# Altium schematic sheet 1.power.SchDoc: 接口及电源
size A4; DrawnBy: 蒋朝晖; Organization: Seneasy; DocumentNumber: 项目编号; Revision: V2.0; SheetNumber: 1; SheetTotal: 2; Time: 2018-10-21
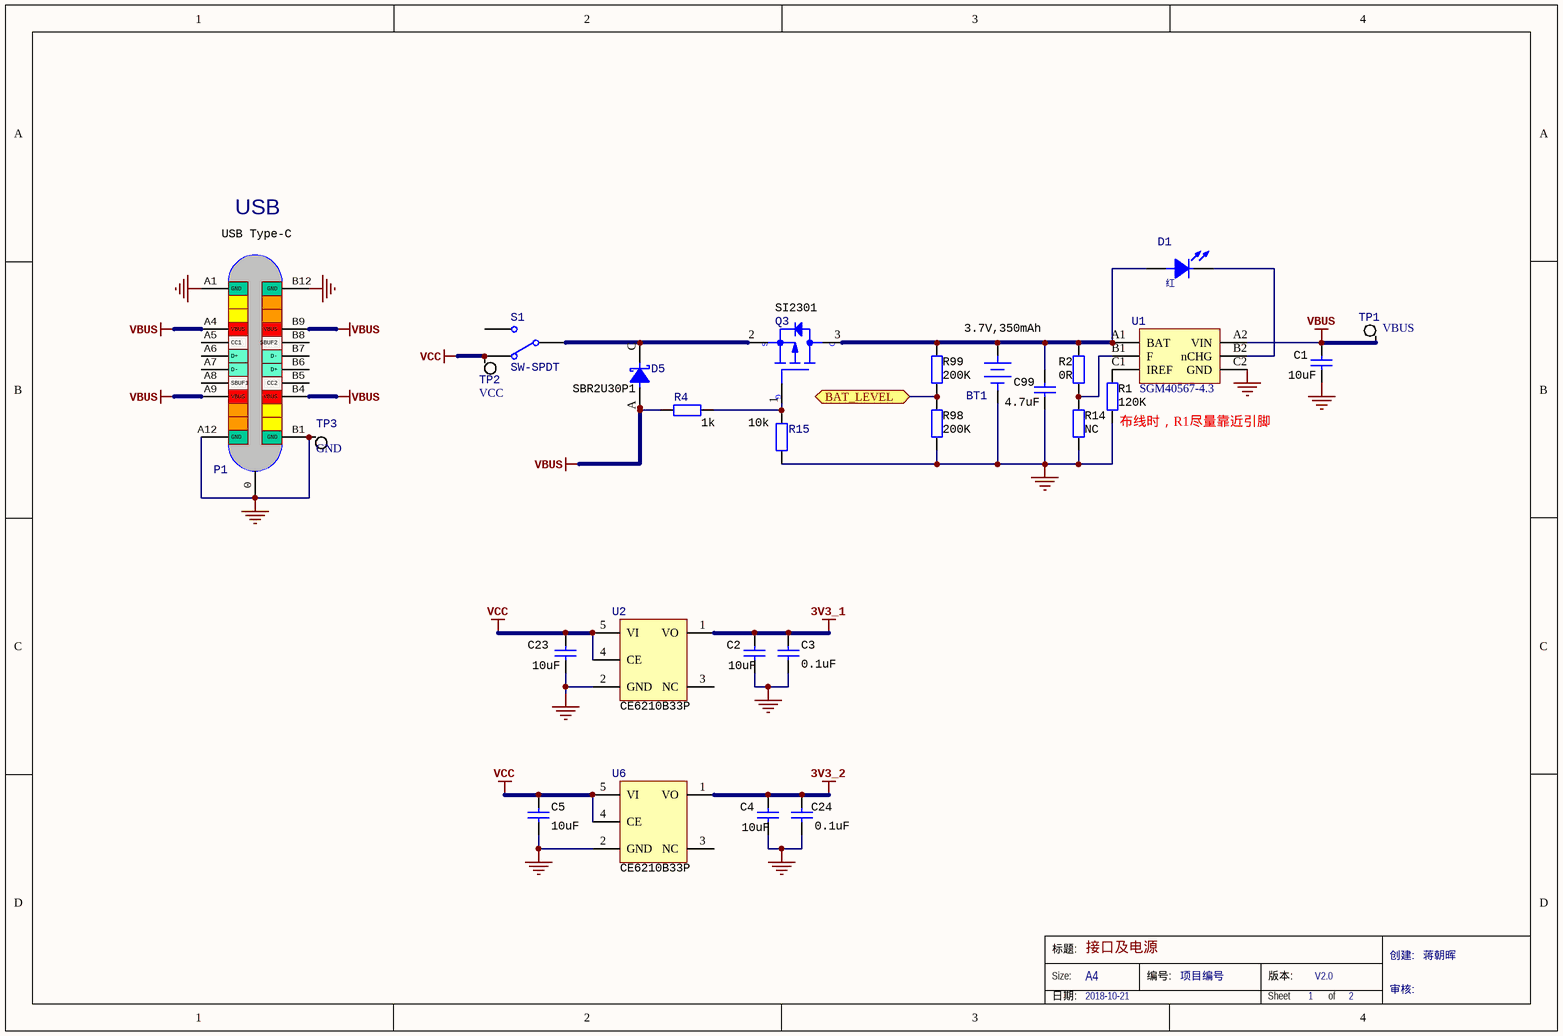
[diagram p0: 1.power.SchDoc]

## Parts
BT1  3.7V,350mAh  [2P/1.0MM立式贴片座子]
C1  10uF  [C0603]
C2  10uF  [0603]
C3  0.1uF  [0402]
C4  10uF  [0603]
C5  10uF  [0603]
C23  10uF  [0603]
C24  0.1uF  [0402]
C99  4.7uF  [C0603]
D1  红  [0603LED]
D5  SBR2U30P1  [POWERDI123]
P1  USB Type-C  [TYPC-16PIN]
Q3  SI2301  [SOT23-3]
R1  120K  [R0402]
R2  0R  [R0402]
R4  1k  [R0402]
R14  NC  [R0402]
R15  10k  [R0402]
R98  200K  [R0402]
R99  200K  [R0402]
S1  SW-SPDT  [SW2]
TP1  VBUS  [测试点]
TP2  VCC  [测试点]
TP3  GND  [测试点]
U1  SGM40567-4.3  [SGM40567]
U2  CE6210B33P  [SOT89-5]
U6  CE6210B33P  [SOT89-5]

## Ports
BAT_LEVEL (bidir)

## Nets
3V3_1: C2.1 C3.2 U2.1(VO)
3V3_2: C4.1 C24.2 U6.1(VO)
NetBT1_2: BT1.2(-) C1.2 C2.2 C3.1 C4.2 C5.2 C23.2 C24.1 C99.2 P1.0(Shield) P1.A1(GND) P1.A12(GND) P1.B1(GND) P1.B12(GND) R1.1 R14.2 R15.1 R98.1 TP3.1 U1.C2(GND) U2.2(GND) U6.2(GND)
VBUS: C1.1 D5.A(ANODE) P1.A4(VBUS) P1.A9(VBUS) P1.B4(VBUS) P1.B9(VBUS) R4.2 TP1.1 U1.A2(VIN)
VCC: C5.1 C23.1 S1.3 TP2.1 U2.4(CE) U2.5(VI) U6.4(CE) U6.5(VI)
BAT_LEVEL: R98.2 R99.1 ; port BAT_LEVEL
NetBT1_1: BT1.1(+) C99.1 D1.A(ANODE) Q3.3(DRAIN) R2.1 R99.2 U1.A1(BAT)
NetD1_C: D1.C(CATHODE) U1.B2(nCHG)
NetD5_C: D5.C(CATHODE) Q3.2(SOURCE) S1.2
NetQ3_1: Q3.1(GATE) R4.1 R15.2
NetR1_2: R1.2 U1.C1(IREF)
NetR2_2: R2.2 R14.1 U1.B1(F)

Not connected (* = marked no-connect by the designer): P1 A5(CC1) A6(D+) A7(D-) A8(SBUF1) B5(CC2) B6(D+) B7(D-) B8(SBUF2); S1 1; U2 3(NC); U6 3(NC)

## Notes on the sheet
- USB
- (near R1) 布线时，R1尽量靠近引脚
- 标题:
- Size:
- A4
- 编号:
- 版本:
- 创建:
- 日期:
- Sheet
- of
- 审核:
- (in symbol PMOS) S; D; G

## Library data of the parts
BT1 = Battery: 4.2V Li-lon; Manufacturer: ?; PackageReference: ?; Value: ?; PartNumber: ?; ComponentLink1URL: ?
C1-C5 C23 C24 C99 = CAP1_npol: CAP, CERM, 0.01uF, 100V, +/-5%, X7R, 0603; PartNumber: 06031C103JAT2A; Manufacturer: AVX; Polarized: N; Tolerance: 5; ESR_Ohm: 0.098; Voltage Rating DC: 25V; RoHS Compliant: Y; MountType: SMT; Dielectric: X7R; ComponentLink1URL: http://www.avx.com/docs/masterpubs/smccp.pdf; Operating Temperature: -55+125C; PackageReference: 0603
  C1 C2 C4 C5 C23: Value: 10uF
  C3 C24: Value: 0.1uF
  C99: Value: 4.7uF
D1 = LED1: Manufacturer: ?; PackageReference: ?; PartNumber: ?; Value: ?
D5 = Diode_Schottky: Published: 8-Jun-2000; LatestRevisionDate: 17-Jul-2002; LatestRevisionNote: Re-released for DXP Platform.; PackageReference: SMB; Publisher: Altium Limited; PackageDescription: DO-214-AA/SMB; 2 C-Bend Leads; Body 5.3 x 3.6 mm, inc. leads (LxW); Code_JEDEC: DO-214-AA; Value: ?; PartNumber: ?; Manufacturer: ?
Q3 = PMOS: Manufacturer: ?; PackageReference: ?; PartNumber: ?; Value: ?
R1 R2 R98 R99 = RES1: RES, 1.0k ohm, 5%, 0.1W, 0603; PartNumber: RC0603JR-071KL; Manufacturer: Yageo America; CompType: Resistor; Res_ohm: 1000; Value_Code: 1k00; Tolerance_%: 5; Power_W: 0.1; VDC_V: 50; TempCo: 100 ppm/C; EIA_Code: E24; U/M: EA; SymbolVersion: 2009-05-29; RoHS: Y; Value1: 5%; Value2: 0.1W; MountType: SMT; Technology: Thick Film; Published: 2008-06-26; Publisher: Texas Instruments; LatestRevisionDate: 2014-04-18; ComponentLink1Description: Datasheet link; ComponentLink1URL: http://www.yageo.com/pdf/Pu-RC0603_51_PbFree_L_2.pdf; Supplier Part Number 1: 311-1.0KGRCT-ND; Supplier 2: Mouser; Supplier Part Number 2: 603-RC0603JR-071KL; Supplier 3: Farnell; Supplier Part Number 3: 9233385; PackageReference: 0603
  R1: Value: 120K
  R2: Value: 0R
  R98 R99: Value: 200K
R4 = Res2: Resistor; Published: 8-Jun-2000; LatestRevisionDate: 17-Jul-2002; LatestRevisionNote: Re-released for DXP Platform.; PackageReference: AXIAL-0.4; Publisher: Altium Limited; PackageDescription: Axial Device, Thru-Hole; 2 Leads; 0.4 in Pin Spacing; Value: 1K
R14 = RES1: RES, 1.0k ohm, 5%, 0.1W, 0603; PartNumber: RC0603JR-071KL; Manufacturer: Yageo America; CompType: Resistor; Res_ohm: 1000; Value_Code: 1k00; Tolerance_%: 5; Power_W: 0.1; VDC_V: 50; TempCo: 100 ppm/C; EIA_Code: E24; U/M: EA; Value: 0R; SymbolVersion: 2009-05-29; RoHS: Y; Value1: 5%; Value2: 0.1W; MountType: SMT; Technology: Thick Film; Published: 2008-06-26; Publisher: Texas Instruments; LatestRevisionDate: 2014-04-18; ComponentLink1Description: Datasheet link; ComponentLink1URL: http://www.yageo.com/pdf/Pu-RC0603_51_PbFree_L_2.pdf; Supplier Part Number 1: 311-1.0KGRCT-ND; Supplier 2: Mouser; Supplier Part Number 2: 603-RC0603JR-071KL; Supplier 3: Farnell; Supplier Part Number 3: 9233385; PackageReference: 0603
R15 = Res2: Resistor; Value: 1K; Published: 8-Jun-2000; LatestRevisionDate: 17-Jul-2002; LatestRevisionNote: Re-released for DXP Platform.; PackageReference: AXIAL-0.4; Publisher: Altium Limited; PackageDescription: Axial Device, Thru-Hole; 2 Leads; 0.4 in Pin Spacing
S1 = SW-SPDT: SPDT Subminiature Toggle Switch, Right Angle Mounting, Vertical Actuation; Published: 24-Mar-1999; LatestRevisionDate: 17-Dec-2003; LatestRevisionNote: Schematic revised, PCB Footprint replaced.; DatasheetVersion: 05-Dec-2000; PackageReference: TL36WW15050; Publisher: Altium Limited; PackageDescription: Switch; 4 Leads; ComponentLink1Description: Manufacturer Link; ComponentLink1URL: http://www.apem.com; 采购网址: http://www.cnhsdz.com/huansheng/products_content-437702.html
TP1-TP3 = TP: Test Point
U1 = SGM40567: 充电IC
U2 U6 = AP2112K